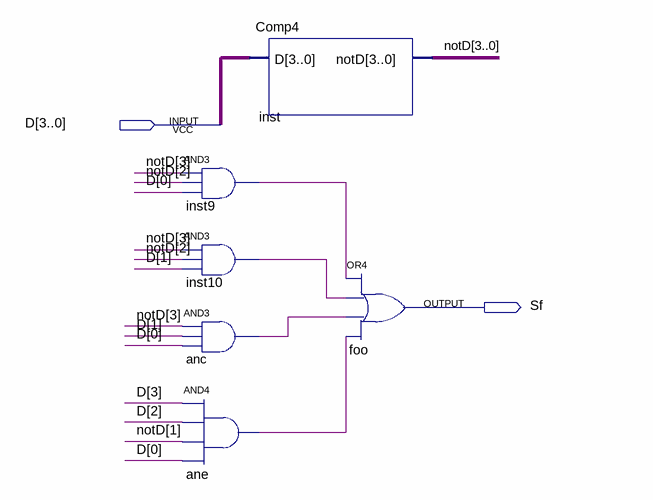
[diagram p0: schematic sheet]
// Quartus schematic Sf.bdf as structural Verilog: 6 symbols, 2 pins
module Sf (
  input  [3:0] D,
  output Sf
);

  wire anc_out, ane_out, inst9_out, inst10_out;
  wire [3:0] notD;

  and inst9 (inst9_out, notD[3], notD[2], D[0]);
  and inst10 (inst10_out, notD[3], notD[2], D[1]);
  and anc (anc_out, notD[3], D[1], D[0]);
  and ane (ane_out, D[3], D[2], notD[1], D[0]);
  Comp4 inst (.D(D), .notD(notD));
  or foo (Sf, inst9_out, inst10_out, anc_out, ane_out);
endmodule
